# Altium project UZ_D_Encoder.PrjPcb (part 2 of 3)

## Sheet Busswitch_B.SchDoc
size A4; Author: Julian Klein; CompanyName: Technische Hochschule Nürnberg Georg Simon Ohm; Organization: UltraZohm; Address1: Kesslerplatz 12; Address2: 90489 Nürnberg; Address3: GERMANY; DocumentNumber: 12; SheetNumber: 12; SheetTotal: 12; Website: www.ultrazohm.com
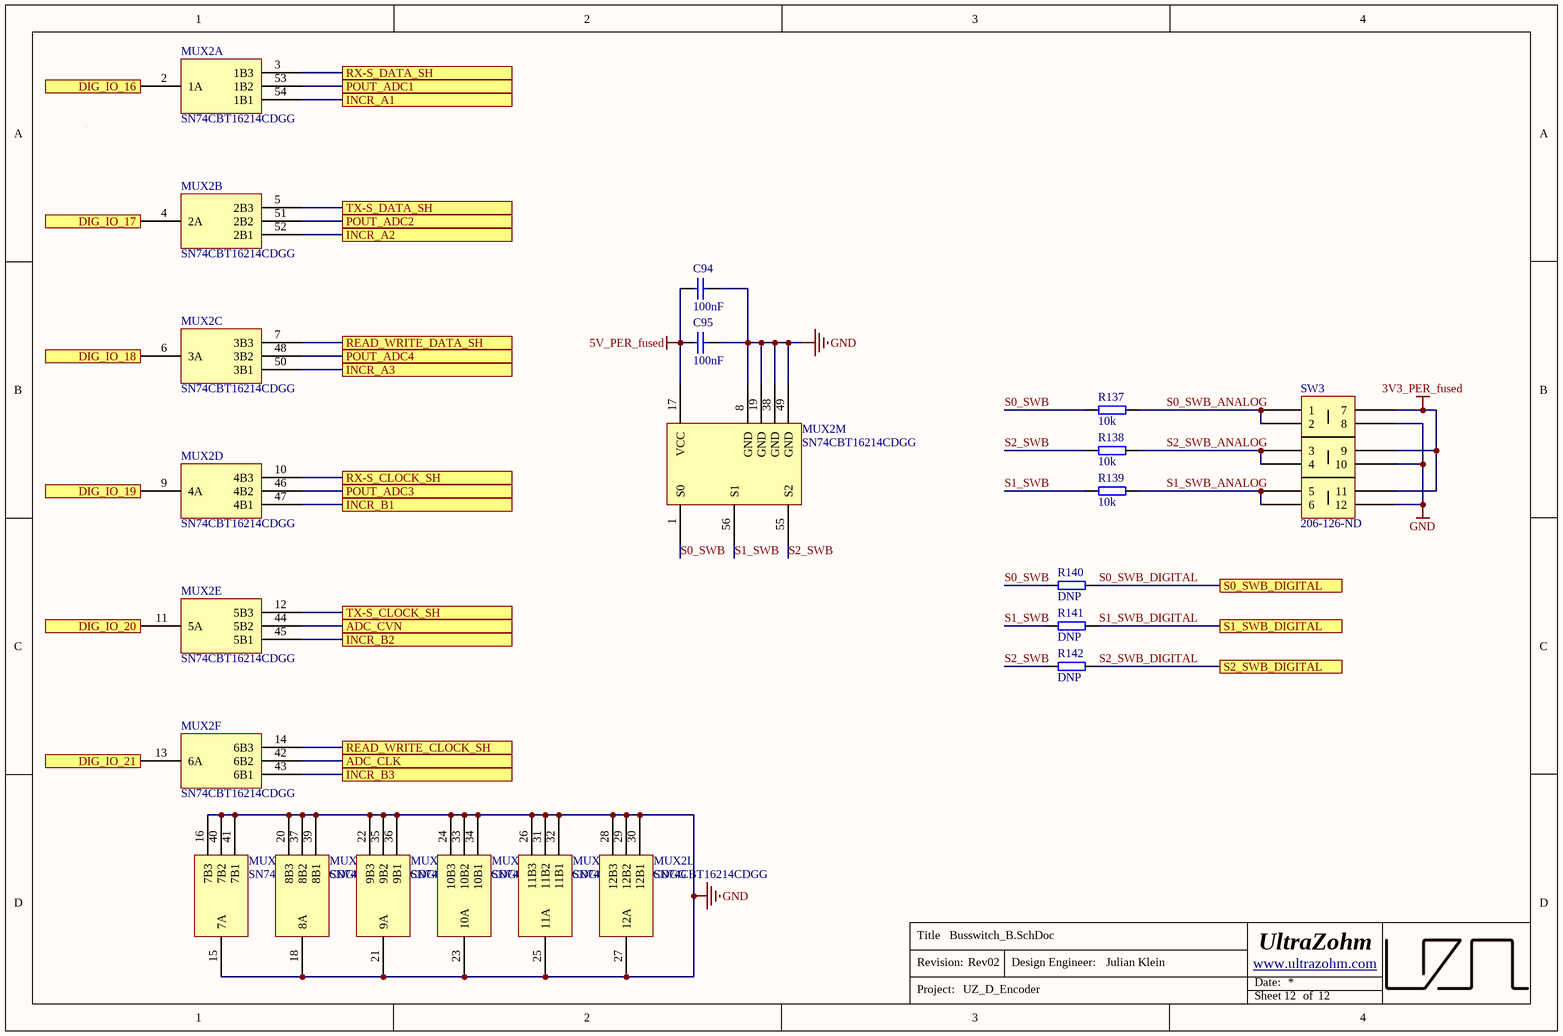
[diagram p8: Busswitch_B.SchDoc]

### Parts
C94  100nF  [CAPC1608X07N]
C95  100nF  [CAPC1608X07N]
MUX2  SN74CBT16214CDGG  [TSSOP50P810X120-56N]  (parts A,B,C,D,E,F,G,H,I,J,K,L,M of 13)
R137  10k  [RESC1608X06N]
R138  10k  [RESC1608X06N]
R139  10k  [RESC1608X06N]
R140  DNP  [RESC1608X06N]
R141  DNP  [RESC1608X06N]
R142  DNP  [RESC1608X06N]
SW3  Supplier Part Number 1: 206-126-ND  [206-123]  (hidden comment: 206-126)

### Ports
ADC_CLK, ADC_CVN, DIG_IO_16, DIG_IO_17, DIG_IO_18, DIG_IO_19, DIG_IO_20, DIG_IO_21, INCR_A1, INCR_A2, INCR_A3, INCR_B1, INCR_B2, INCR_B3, POUT_ADC1, POUT_ADC2, POUT_ADC3, POUT_ADC4, READ_WRITE_CLOCK_SH, READ_WRITE_DATA_SH, RX-S_CLOCK_SH, RX-S_DATA_SH, S0_SWB_DIGITAL, S1_SWB_DIGITAL, S2_SWB_DIGITAL, TX-S_CLOCK_SH, TX-S_DATA_SH

### Nets
3V3_PER_fused: SW3.7 SW3.9 SW3.11
5V_PER_fused: C94.1 C95.1 MUX2.17(VCC)
GND: C94.2 C95.2 MUX2.8(GND) MUX2.15(7A) MUX2.16(7B3) MUX2.18(8A) MUX2.19(GND) MUX2.20(8B3) MUX2.21(9A) MUX2.22(9B3) MUX2.23(10A) MUX2.24(10B3) MUX2.25(11A) MUX2.26(11B3) MUX2.27(12A) MUX2.28(12B3) MUX2.29(12B2) MUX2.30(12B1) MUX2.31(11B2) MUX2.32(11B1) MUX2.33(10B2) MUX2.34(10B1) MUX2.35(9B2) MUX2.36(9B1) MUX2.37(8B2) MUX2.38(GND) MUX2.39(8B1) MUX2.40(7B2) MUX2.41(7B1) MUX2.49(GND) SW3.8 SW3.10 SW3.12
ADC_CLK: MUX2.42(6B2) ; port ADC_CLK
ADC_CVN: MUX2.44(5B2) ; port ADC_CVN
ADC_OUT_P1: MUX2.53(1B2) ; port POUT_ADC1
ADC_OUT_P2: MUX2.51(2B2) ; port POUT_ADC2
ADC_OUT_P3: MUX2.46(4B2) ; port POUT_ADC3
ADC_OUT_P4: MUX2.48(3B2) ; port POUT_ADC4
DIG_IO_16: MUX2.2(1A) ; port DIG_IO_16
DIG_IO_17: MUX2.4(2A) ; port DIG_IO_17
DIG_IO_18: MUX2.6(3A) ; port DIG_IO_18
DIG_IO_19: MUX2.9(4A) ; port DIG_IO_19
DIG_IO_20: MUX2.11(5A) ; port DIG_IO_20
DIG_IO_21: MUX2.13(6A) ; port DIG_IO_21
INCR_A1: MUX2.54(1B1) ; port INCR_A1
INCR_A2: MUX2.52(2B1) ; port INCR_A2
INCR_A3: MUX2.50(3B1) ; port INCR_A3
INCR_B1: MUX2.47(4B1) ; port INCR_B1
INCR_B2: MUX2.45(5B1) ; port INCR_B2
INCR_B3: MUX2.43(6B1) ; port INCR_B3
READ_WRITE_CLOCK_SH: MUX2.14(6B3) ; port READ_WRITE_CLOCK_SH
READ_WRITE_DATA_SH: MUX2.7(3B3) ; port READ_WRITE_DATA_SH
RX-S_CLOCK_SH: MUX2.10(4B3) ; port RX-S_CLOCK_SH
RX-S_DATA_SH: MUX2.3(1B3) ; port RX-S_DATA_SH
S0_SWB: MUX2.1(S0) R137.2 R140.2
S0_SWB_ANALOG: R137.1 SW3.1 SW3.2
S0_SWB_DIGITAL: R140.1 ; port S0_SWB_DIGITAL  [project net P5]
S1_SWB: MUX2.56(S1) R139.2 R141.2
S1_SWB_ANALOG: R139.1 SW3.5 SW3.6
S1_SWB_DIGITAL: R141.1 ; port S1_SWB_DIGITAL  [project net P6]
S2_SWB: MUX2.55(S2) R138.2 R142.2
S2_SWB_ANALOG: R138.1 SW3.3 SW3.4
S2_SWB_DIGITAL: R142.1 ; port S2_SWB_DIGITAL  [project net P7]
TX-S_CLOCK_SH: MUX2.12(5B3) ; port TX-S_CLOCK_SH
TX-S_DATA_SH: MUX2.5(2B3) ; port TX-S_DATA_SH

### Notes on the sheet
- Title
- Revision:
- Design Engineer:
- Date:
- Project:
- Sheet
- of

### Library data of the parts
C94 C95 = Cap_0603: as C98 on sheet Analog Hall; Value: 100nF; Supplier 1: Mouser; Supplier 2: *; Supplier Part Number 1: 710-885012206071; Supplier Part Number 2: *
MUX2 = SN74CBT16214CDGG: Multiplexer/Demultiplexer Bus Switch 1-Element CMOS 36-IN 56-Pin TSSOP Tube; Manufacturer: Texas Instruments; Supplier 1: Arrow Electronics; Manufacturer Part Number: SN74CBT16214CDGG; RoHS: Yes; Case/Package: TSSOP; RoHS Compliant: Yes; Supplier Part Number 1: SN74CBT16214CDGG
R137-R142 = R_0603: MPN: CRCW06030000Z0EAC; MF: Vishay; Supplier 1: Mouser; Supplier Part Number 1: 71-CRCW06030000Z0EAC
  R137-R139: Value: 10k
  R140-R142: Value: DNP
SW3 = 206-126: Switch DIP OFF ON SPDT 6 Raised Slide 0.05A 24VDC PC Pins 2.54mm Thru-Hole Tube; Manufacturer: CTS; Body Material: Plastic; Voltage Rating (DC): 24V; Number of Positions: 6; Current Rating: 50mA; Electrical Life: 10000Cycles; Actuator Type: Slide (Standard); Pitch: 0.1inch; Washable: No; Supplier 1: Digi-Key; Manufacturer Part Number: 206-126; RoHS: Yes; Category: DIP Switches; Pricing 1: 1005=1,10898 (USD); Mount: Through Hole; Contact Plating: Gold; Min Operating Temperature: -55°C; Max Operating Temperature: 85°C; Packaging: Rail/Tube; Termination: PC Pin; Package Quantity: 15; Throw Configuration: SPDT; Series: 206; Max Voltage Rating (DC): 24V; Length: 1.286inch; Terminal Pitch: 2.54mm; Radiation Hardening: No; RoHS Compliant: Yes; ComponentLink1URL: https://datasheet.ciiva.com/8677/206-208-8677008.pdf?src-supplier=Avnet; ComponentLink1Description: https://datasheet.ciiva.com/8677/206-208-8677008.pdf?src-supplier=Avnet; ComponentLink2URL: https://datasheet.ciiva.com/12451/206-208-11732-12451385.pdf?src-supplier=Mouser; ComponentLink2Description: https://datasheet.ciiva.com/12451/206-208-11732-12451385.pdf?src-supplier=Mouser

## Sheet Busswitch_A.SchDoc
size A4; Author: Julian Klein; CompanyName: Technische Hochschule Nürnberg Georg Simon Ohm; Organization: UltraZohm; Address1: Kesslerplatz 12; Address2: 90489 Nürnberg; Address3: GERMANY; DocumentNumber: 12; SheetNumber: 12; SheetTotal: 12; Website: www.ultrazohm.com
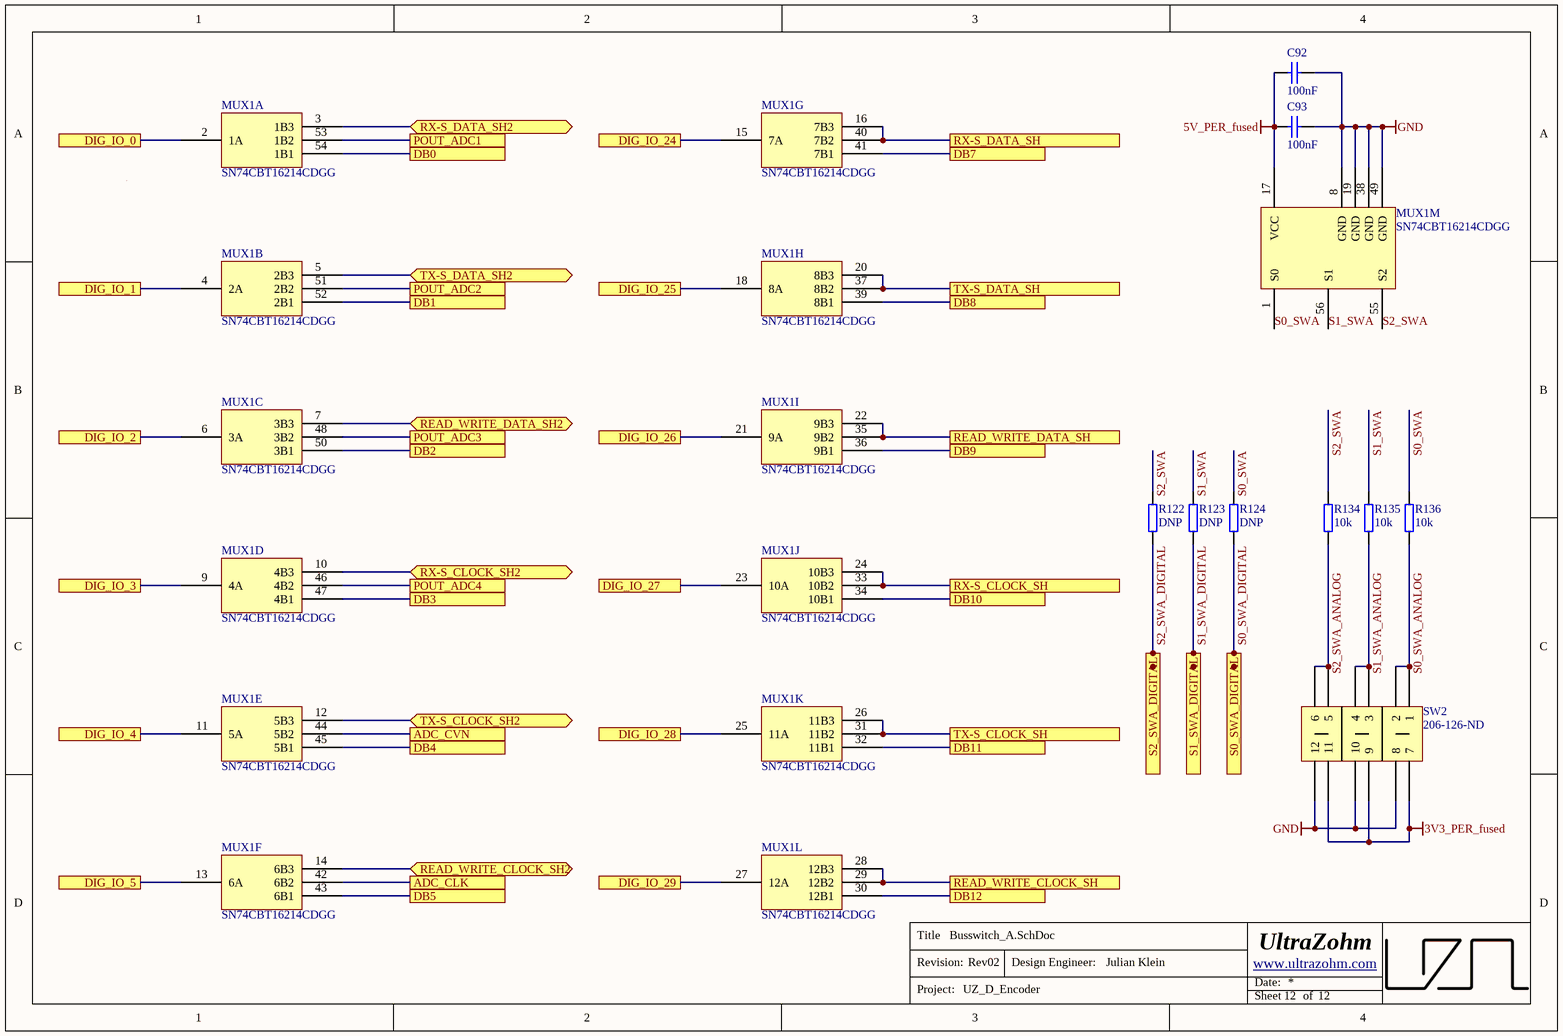
[diagram p9: Busswitch_A.SchDoc]

### Parts
C92  100nF  [CAPC1608X07N]
C93  100nF  [CAPC1608X07N]
MUX1  SN74CBT16214CDGG  [TSSOP50P810X120-56N]  (parts A,B,C,D,E,F,G,H,I,J,K,L,M of 13)
R122  DNP  [RESC1608X06N]
R123  DNP  [RESC1608X06N]
R124  DNP  [RESC1608X06N]
R134  10k  [RESC1608X06N]
R135  10k  [RESC1608X06N]
R136  10k  [RESC1608X06N]
SW2  Supplier Part Number 1: 206-126-ND  [206-123]  (hidden comment: 206-126)

### Ports
ADC_CLK, ADC_CVN, DB0, DB1, DB2, DB3, DB4, DB5, DB7, DB8, DB9, DB10, DB11, DB12, DIG_IO_0, DIG_IO_1, DIG_IO_2, DIG_IO_3, DIG_IO_4, DIG_IO_5, DIG_IO_24, DIG_IO_25, DIG_IO_26, DIG_IO_27, DIG_IO_28, DIG_IO_29, POUT_ADC1, POUT_ADC2, POUT_ADC3, POUT_ADC4, READ_WRITE_CLOCK_SH, READ_WRITE_CLOCK_SH2 (bidir), READ_WRITE_DATA_SH, READ_WRITE_DATA_SH2 (bidir), RX-S_CLOCK_SH, RX-S_CLOCK_SH2 (bidir), RX-S_DATA_SH, RX-S_DATA_SH2 (bidir), S0_SWA_DIGITAL, S1_SWA_DIGITAL, S2_SWA_DIGITAL, TX-S_CLOCK_SH, TX-S_CLOCK_SH2 (bidir), TX-S_DATA_SH, TX-S_DATA_SH2 (bidir)

### Nets
3V3_PER_fused: SW2.7 SW2.9 SW2.11
5V_PER_fused: C92.1 C93.1 MUX1.17(VCC)
GND: C92.2 C93.2 MUX1.8(GND) MUX1.19(GND) MUX1.38(GND) MUX1.49(GND) SW2.8 SW2.10 SW2.12
ADC_CLK: MUX1.42(6B2) ; port ADC_CLK
ADC_CVN: MUX1.44(5B2) ; port ADC_CVN
ADC_OUT_P1: MUX1.53(1B2) ; port POUT_ADC1
ADC_OUT_P2: MUX1.51(2B2) ; port POUT_ADC2
ADC_OUT_P3: MUX1.48(3B2) ; port POUT_ADC3
ADC_OUT_P4: MUX1.46(4B2) ; port POUT_ADC4
DB0: MUX1.54(1B1) ; port DB0
DB1: MUX1.52(2B1) ; port DB1
DB2: MUX1.50(3B1) ; port DB2
DB3: MUX1.47(4B1) ; port DB3
DB4: MUX1.45(5B1) ; port DB4
DB5: MUX1.43(6B1) ; port DB5
DB7: MUX1.41(7B1) ; port DB7
DB8: MUX1.39(8B1) ; port DB8
DB9: MUX1.36(9B1) ; port DB9
DB10: MUX1.34(10B1) ; port DB10
DB11: MUX1.32(11B1) ; port DB11
DB12: MUX1.30(12B1) ; port DB12
DIG_IO_0: MUX1.2(1A) ; port DIG_IO_0
DIG_IO_1: MUX1.4(2A) ; port DIG_IO_1
DIG_IO_2: MUX1.6(3A) ; port DIG_IO_2
DIG_IO_3: MUX1.9(4A) ; port DIG_IO_3
DIG_IO_4: MUX1.11(5A) ; port DIG_IO_4
DIG_IO_5: MUX1.13(6A) ; port DIG_IO_5
DIG_IO_24: MUX1.15(7A) ; port DIG_IO_24
DIG_IO_25: MUX1.18(8A) ; port DIG_IO_25
DIG_IO_26: MUX1.21(9A) ; port DIG_IO_26
DIG_IO_27: MUX1.23(10A) ; port DIG_IO_27
DIG_IO_28: MUX1.25(11A) ; port DIG_IO_28
DIG_IO_29: MUX1.27(12A) ; port DIG_IO_29
READ_WRITE_CLOCK_SH: MUX1.28(12B3) MUX1.29(12B2) ; port READ_WRITE_CLOCK_SH
READ_WRITE_DATA_SH: MUX1.22(9B3) MUX1.35(9B2) ; port READ_WRITE_DATA_SH
RX-S_CLOCK_SH: MUX1.24(10B3) MUX1.33(10B2) ; port RX-S_CLOCK_SH
RX-S_DATA_SH: MUX1.16(7B3) MUX1.40(7B2) ; port RX-S_DATA_SH
S0_SWA: MUX1.1(S0) R124.2 R136.2
S0_SWA_ANALOG: R136.1 SW2.1 SW2.2
S0_SWA_DIGITAL: R124.1 ; port S0_SWA_DIGITAL  [project net P0]
S1_SWA: MUX1.56(S1) R123.2 R135.2
S1_SWA_ANALOG: R135.1 SW2.3 SW2.4
S1_SWA_DIGITAL: R123.1 ; port S1_SWA_DIGITAL  [project net P1]
S2_SWA: MUX1.55(S2) R122.2 R134.2
S2_SWA_ANALOG: R134.1 SW2.5 SW2.6
S2_SWA_DIGITAL: R122.1 ; port S2_SWA_DIGITAL  [project net P2]
TX-S_CLOCK_SH: MUX1.26(11B3) MUX1.31(11B2) ; port TX-S_CLOCK_SH
TX-S_DATA_SH: MUX1.20(8B3) MUX1.37(8B2) ; port TX-S_DATA_SH
NetMUX1_3: MUX1.3(1B3) ; port RX-S_DATA_SH2
NetMUX1_5: MUX1.5(2B3) ; port TX-S_DATA_SH2
NetMUX1_7: MUX1.7(3B3) ; port READ_WRITE_DATA_SH2
NetMUX1_10: MUX1.10(4B3) ; port RX-S_CLOCK_SH2
NetMUX1_12: MUX1.12(5B3) ; port TX-S_CLOCK_SH2
NetMUX1_14: MUX1.14(6B3) ; port READ_WRITE_CLOCK_SH2

### Notes on the sheet
- Title
- Revision:
- Design Engineer:
- Date:
- Project:
- Sheet
- of

### Library data of the parts
C92 C93 = Cap_0603: as C98 on sheet Analog Hall; Value: 100nF; Supplier 1: Mouser; Supplier 2: *; Supplier Part Number 1: 710-885012206071; Supplier Part Number 2: *
MUX1 = SN74CBT16214CDGG: as MUX2 on sheet Busswitch_B; Supplier 1: Arrow Electronics; Manufacturer Part Number: SN74CBT16214CDGG; RoHS: Yes; Case/Package: TSSOP; RoHS Compliant: Yes; Supplier Part Number 1: SN74CBT16214CDGG
R122-R124 R134-R136 = R_0603: MPN: CRCW06030000Z0EAC; MF: Vishay; Supplier 1: Mouser; Supplier Part Number 1: 71-CRCW06030000Z0EAC
  R122-R124: Value: DNP
  R134-R136: Value: 10k
SW2 = 206-126: as SW3 on sheet Busswitch_B; Supplier 1: Digi-Key; Manufacturer Part Number: 206-126; RoHS: Yes; Category: DIP Switches; Pricing 1: 1005=1,10898 (USD); Mount: Through Hole; Contact Plating: Gold; Min Operating Temperature: -55°C; Max Operating Temperature: 85°C; Packaging: Rail/Tube; Termination: PC Pin; Package Quantity: 15; Throw Configuration: SPDT; Series: 206; Max Voltage Rating (DC): 24V; Length: 1.286inch; Terminal Pitch: 2.54mm; Radiation Hardening: No; RoHS Compliant: Yes; ComponentLink1URL: https://datasheet.ciiva.com/8677/206-208-8677008.pdf?src-supplier=Avnet; ComponentLink1Description: https://datasheet.ciiva.com/8677/206-208-8677008.pdf?src-supplier=Avnet; ComponentLink2URL: https://datasheet.ciiva.com/12451/206-208-11732-12451385.pdf?src-supplier=Mouser; ComponentLink2Description: https://datasheet.ciiva.com/12451/206-208-11732-12451385.pdf?src-supplier=Mouser

## Sheet Absolute Encoder.SchDoc
size A4; Author: Julian Klein; CompanyName: Technische Hochschule Nürnberg Georg Simon Ohm; Organization: UltraZohm; Address1: Kesslerplatz 12; Address2: 90489 Nürnberg; Address3: GERMANY; DocumentNumber: 2; SheetNumber: 2; SheetTotal: 12; Website: www.ultrazohm.com
Used 2 times, as channels Absolute encoder, Absolute encoder2. Parts and nets are listed once, with the designators drawn on the sheet.
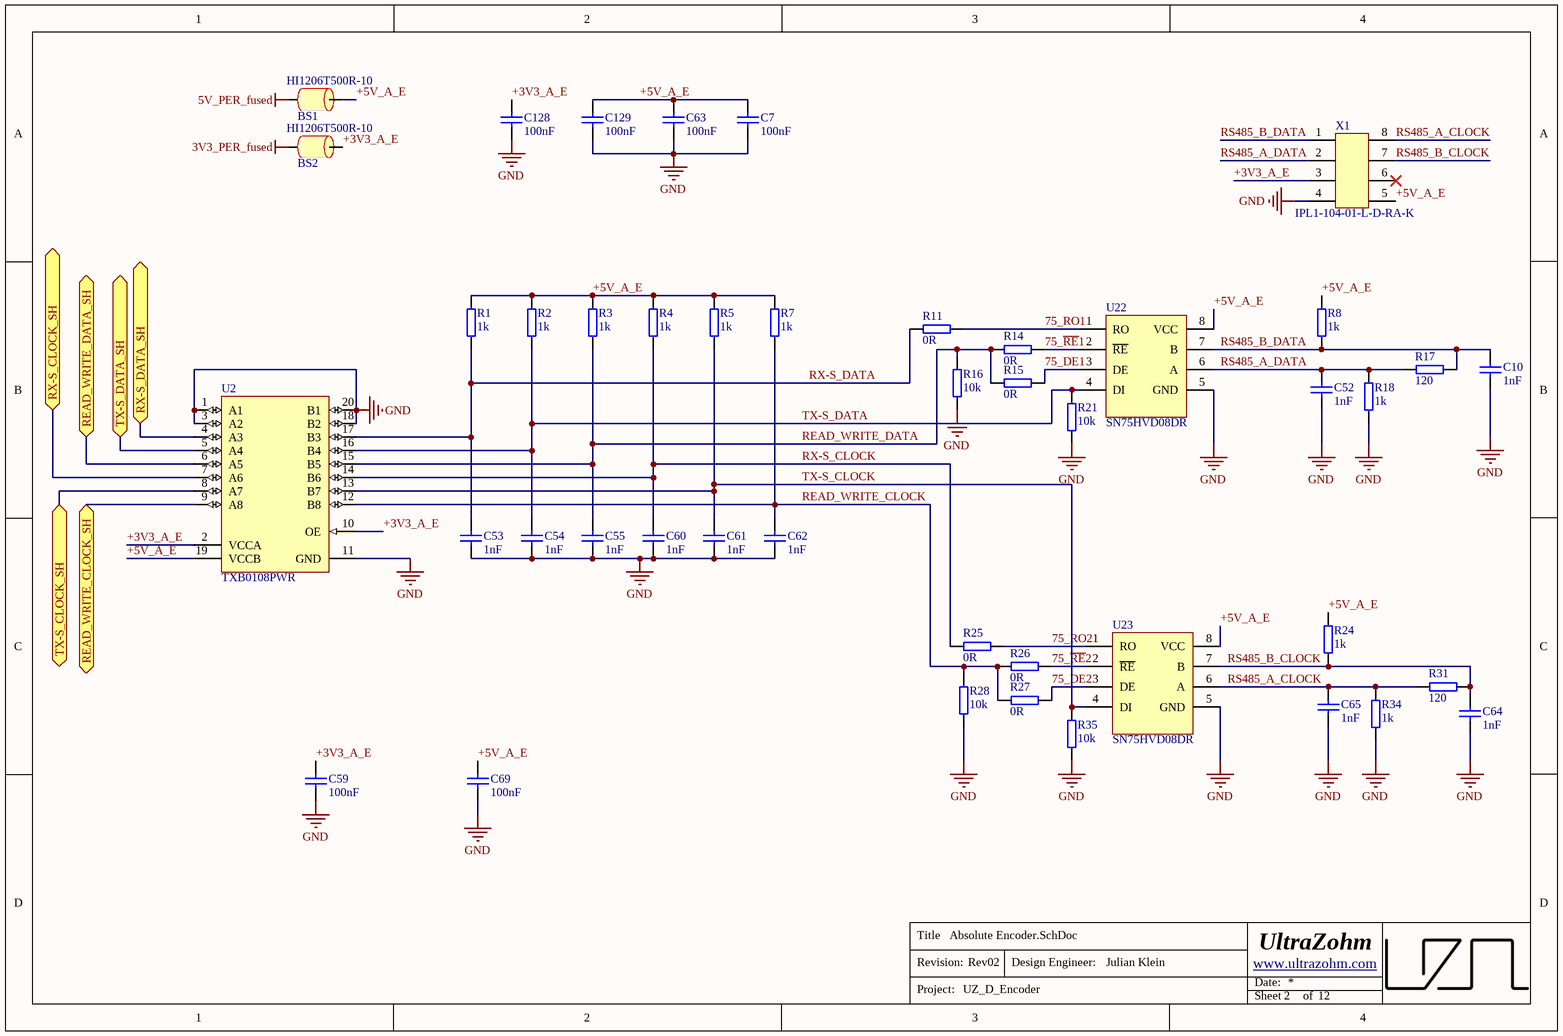
[diagram p10: Absolute Encoder.SchDoc]

### Parts
BS1  HI1206T500R-10  [RES_1206]
BS2  HI1206T500R-10  [RES_1206]
C7  100nF  [CAPC1608X07N]
C10  1nF  [CAPC1608X07N]
C52  1nF  [CAPC1608X07N]
C53  1nF  [CAPC1608X07N]
C54  1nF  [CAPC1608X07N]
C55  1nF  [CAPC1608X07N]
C59  100nF  [CAPC1608X07N]
C60  1nF  [CAPC1608X07N]
C61  1nF  [CAPC1608X07N]
C62  1nF  [CAPC1608X07N]
C63  100nF  [CAPC1608X07N]
C64  1nF  [CAPC1608X07N]
C65  1nF  [CAPC1608X07N]
C69  100nF  [CAPC1608X07N]
C128  100nF  [CAPC1608X07N]
C129  100nF  [CAPC1608X07N]
R1  1k  [RESC1608X06N]
R2  1k  [RESC1608X06N]
R3  1k  [RESC1608X06N]
R4  1k  [RESC1608X06N]
R5  1k  [RESC1608X06N]
R7  1k  [RESC1608X06N]
R8  1k  [RESC1608X06N]
R11  0R  [RESC1608X06N]
R14  0R  [RESC1608X06N]
R15  0R  [RESC1608X06N]
R16  10k  [RESC1608X06N]
R17  120  [RESC1608X06N]
R18  1k  [RESC1608X06N]
R21  10k  [RESC1608X06N]
R24  1k  [RESC1608X06N]
R25  0R  [RESC1608X06N]
R26  0R  [RESC1608X06N]
R27  0R  [RESC1608X06N]
R28  10k  [RESC1608X06N]
R31  120  [RESC1608X06N]
R34  1k  [RESC1608X06N]
R35  10k  [RESC1608X06N]
U2  TXB0108PWR  [PW0020A_L]
U22  SN75HVD08DR  [SOIC8_N]
U23  SN75HVD08DR  [SOIC8_N]
X1  IPL1-104-01-L-D-RA-K  [Conector 4x2 TH Horizontal]

### Ports
READ_WRITE_CLOCK_SH (bidir), READ_WRITE_DATA_SH (bidir), RX-S_CLOCK_SH (bidir), RX-S_DATA_SH (bidir), TX-S_CLOCK_SH (bidir), TX-S_DATA_SH (bidir)

### Nets
3V3_PER_fused: BS2.2
5V_PER_fused: BS1.2
GND: C7.2 C10.2 C52.2 C53.2 C54.2 C55.2 C59.2 C60.2 C61.2 C62.2 C63.2 C64.2 C65.2 C69.2 C128.2 C129.2 R16.1 R18.1 R21.1 R28.1 R34.1 R35.1 U2.1(A1) U2.3(A2) U2.11(GND) U2.18(B2) U2.20(B1) U22.5(GND) U23.5(GND) X1.4
75_DE1: R15.2 U22.3(DE)
75_DE2: R27.2 U23.3(DE)
75_~{RE}1: R14.2 U22.2(~{RE})
75_~{RE}2: R26.2 U23.2(~{RE})
75_RO1: R11.2 U22.1(RO)
75_RO2: R25.2 U23.1(RO)
+3V3_A_E: BS2.1 C59.1 C128.1 U2.2(VCCA) U2.10(OE) X1.3
+5V_A_E: BS1.1 C7.1 C63.1 C69.1 C129.1 R1.2 R2.2 R3.2 R4.2 R5.2 R7.2 R8.2 R24.2 U2.19(VCCB) U22.8(VCC) U23.8(VCC) X1.5
READ_WRITE_CLOCK: C62.1 R7.1 R26.1 R27.1 R28.2 U2.12(B8)
READ_WRITE_CLOCK_SH: U2.9(A8) ; port READ_WRITE_CLOCK_SH
READ_WRITE_DATA: C55.1 R3.1 R14.1 R15.1 R16.2 U2.15(B5)
READ_WRITE_DATA_SH: U2.6(A5) ; port READ_WRITE_DATA_SH
RS485_A_CLOCK: C65.1 R31.2 R34.2 U23.6(A) X1.8
RS485_A_DATA: C52.1 R17.2 R18.2 U22.6(A) X1.2
RS485_B_CLOCK: C64.1 R24.1 R31.1 U23.7(B) X1.7
RS485_B_DATA: C10.1 R8.1 R17.1 U22.7(B) X1.1
RX-S_CLOCK: C60.1 R4.1 R25.1 U2.14(B6)
RX-S_CLOCK_SH: U2.7(A6) ; port RX-S_CLOCK_SH
RX-S_DATA: C53.1 R1.1 R11.1 U2.17(B3)
RX-S_DATA_SH: U2.4(A3) ; port RX-S_DATA_SH
TX-S_CLOCK: C61.1 R5.1 R35.2 U2.13(B7) U23.4(DI)
TX-S_CLOCK_SH: U2.8(A7) ; port TX-S_CLOCK_SH
TX-S_DATA: C54.1 R2.1 R21.2 U2.16(B4) U22.4(DI)
TX-S_DATA_SH: U2.5(A4) ; port TX-S_DATA_SH

Not connected (* = marked no-connect by the designer): X1 6*

### Channels
Absolute encoder: designators end in A; ports READ_WRITE_CLOCK_SH=READ_WRITE_CLOCK_SH READ_WRITE_DATA_SH=READ_WRITE_DATA_SH RX-S_CLOCK_SH=RX-S_CLOCK_SH RX-S_DATA_SH=RX-S_DATA_SH TX-S_CLOCK_SH=TX-S_CLOCK_SH TX-S_DATA_SH=TX-S_DATA_SH
Absolute encoder2: designators end in B; ports READ_WRITE_CLOCK_SH=NetMUX1_14 READ_WRITE_DATA_SH=NetMUX1_7 RX-S_CLOCK_SH=NetMUX1_3 RX-S_DATA_SH=NetMUX1_10 TX-S_CLOCK_SH=NetMUX1_12 TX-S_DATA_SH=NetMUX1_5

### Notes on the sheet
- Title
- Revision:
- Design Engineer:
- Date:
- Project:
- Sheet
- of

### Library data of the parts
BS1 BS2 = Bead: Ferrite bead 6A; MF: Laird; Supplier Part Number 2: 240-2412-1-ND; MFN: HI1206T500R-10; Supplier 2: Digi-Key; Supplier 1: Mouser; Supplier Part Number 1: 875-HI1206T500R-10; Package: 1206
C7 C63 C69 C129 = Cap_0603: MPN: 885012206071; MF: Würth; Voltage: 16V; Value: 100nF; Supplier 1: Mouser; Supplier 2: *; Supplier Part Number 1: 710-885012206071; Supplier Part Number 2: *
C10 C52 C64 C65 = Cap_0603: Voltage: 16V; Value: 1nF; MF: *; MPN: *; Supplier 1: *; Supplier 2: *; Supplier Part Number 1: *; Supplier Part Number 2: *
C53-C55 C59-C62 C128 = Cap_0603: as C98 on sheet Analog Hall; Supplier 1: Mouser; Supplier 2: *; Supplier Part Number 1: 710-885012206071; Supplier Part Number 2: *
  C53-C55 C60-C62: Value: 1nF
  C59 C128: Value: 100nF
R1-R5 R7 R8 R18 R24 R34 = R_0603: MPN: RC0603FR-071KL; MF: Yageo; Value: 1k; Supplier 1: Mouser; Supplier Part Number 1: 603-RC0603FR-071KL
R11 R14-R16 R21 R25-R28 R35 = R_0603: MPN: CRCW06030000Z0EAC; MF: Vishay; Supplier 1: Mouser; Supplier Part Number 1: 71-CRCW06030000Z0EAC
  R11 R14 R15 R25-R27: Value: 0R
  R16 R21 R28 R35: Value: 10k
R17 R31 = R_0603: Value: 120; MF: *; MPN: *; Supplier 1: *; Supplier Part Number 1: *
U2 = CMP-2000-07337-1: TXB0108 8-Bit Bidirectional Voltage-Level Translator with Auto-Direction Sensing and / +/- 15-kV ESD Protection, 1.2 to 3.6 V, -40 to 85 degC, 20-Pin TSSOP (PW), Green (RoHS & no Sb/Br), Tape and Reel; Manufacturer: Texas Instruments; Propagation Delay (Max): 4ns; Logic Function: Translator,Bidirectional; Input Type: Logic; Package Version: 4040064-5/G, 02/2011; Voltage - Supply: 1.2V~3.6V,1.65V~5.5V; Data Rate: 100Mbps; Other Names: 296-21527-6; Number of Channels: 8; Differential - Input: Output:No/No; Number of Outputs/Channel: 1; Product Training Modules: VoltageLevelTranslation; Dynamic Catalog: TXBSeries; Package Reference: PW20; Package Description: 20-Pin Small Outline Package Integrated Circuit, Body 6.5 x 4.4 mm, Pitch 0.65 mm; Category: IntegratedCircuits(ICs); Datasheet URL: http://www.ti.com/general/docs/lit/getliterature.tsp?genericPartNumber=TXB0108&fileType=pdf; Package / Case: 20-TSSOP(0.173",4.40mmWidth); Family: Logic-Translators; Standard Package: 1; Series: -; Manufacturer URL: http://www.ti.com/; Number of Bits: 8; Package URL: http://www.ti.com/litv/pdf/mpds362; Output Type: Logic; Datasheet Version: Rev. F, 12/2014; Packaging: Digi-Reel®; Operating Temperature: -40°C~85°C; Supplier Device Package: 20-TSSOP; Mounting Technology: SurfaceMount
U22 U23 = Transmisor RS485: IC TRANSCEIVER HALF 1/1 8SOIC; MF: Texas Instruments; Supplier Part Number 2: 296-37893-1-ND; MPN: SN75HVD08DR; Supplier Part Number 1: 595-SN75HVD08DR; Package: SOIC-8; Supplier 1: Mouser; Supplier 2: Digi-Key
X1 = Conector 4x2 Horizontal: CONN HEADER R/A 8POS 2.54MM Through Hole; MF: Samtec; Supplier Part Number 2: SAM9596-ND; MPN: IPL1-104-01-L-D-RA-K; Supplier Part Number 1: 200-IPL110401LDRAK; Supplier 1: Mouser; Supplier 2: Digi-Key

## Sheet Resolver.SchDoc
size A4; Author: Julian Klein; CompanyName: Technische Hochschule Nürnberg Georg Simon Ohm; Organization: UltraZohm; Address1: Kesslerplatz 12; Address2: 90489 Nürnberg; Address3: GERMANY; DocumentNumber: 10; SheetNumber: 10; SheetTotal: 12; Website: www.ultrazohm.com
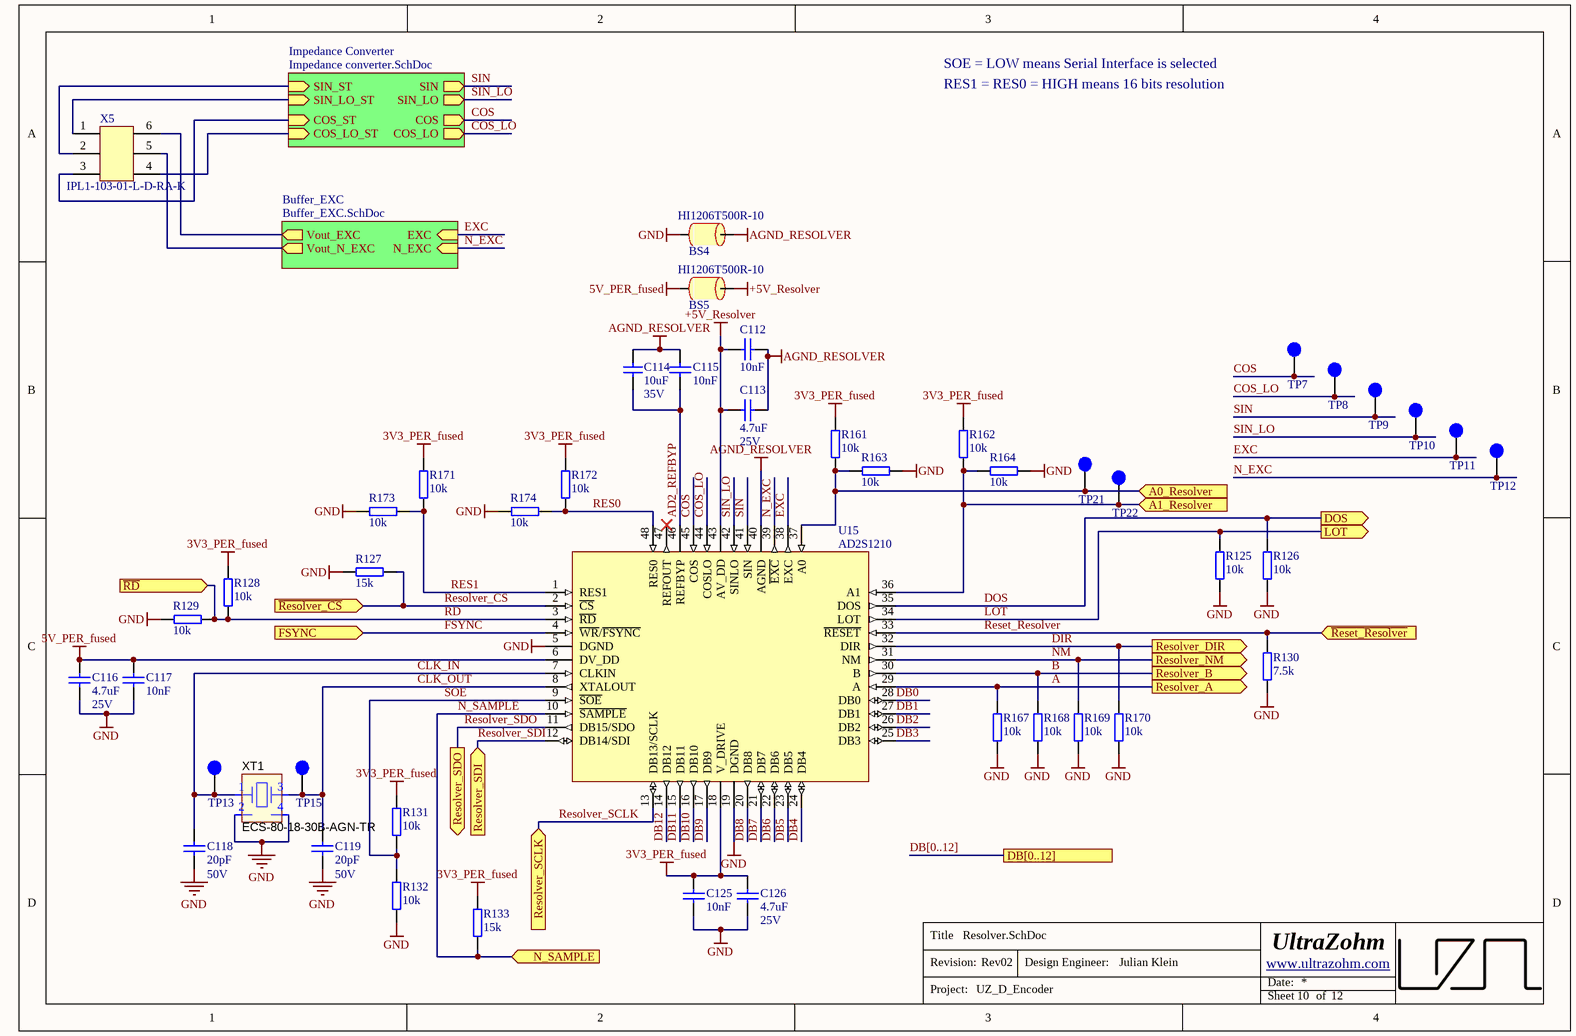
[diagram p11: Resolver.SchDoc]

### Parts
BS4  HI1206T500R-10  [RES_1206]
BS5  HI1206T500R-10  [RES_1206]
C112  10nF  [CAPC1608X07N]
C113  4.7uF  Voltage: 25V  [CAPC1608X07N]
C114  10uF  Voltage: 35V  [C_1206]
C115  10nF  [CAPC1608X07N]
C116  4.7uF  Voltage: 25V  [CAPC1608X07N]
C117  10nF  [CAPC1608X07N]
C118  20pF  Voltage: 50V  [CAPC1608X07N]
C119  20pF  Voltage: 50V  [CAPC1608X07N]
C125  10nF  [CAPC1608X07N]
C126  4.7uF  Voltage: 25V  [CAPC1608X07N]
R125  10k  [RESC1608X06N]
R126  10k  [RESC1608X06N]
R127  15k  [RESC1608X06N]
R128  10k  [RESC1608X06N]
R129  10k  [RESC1608X06N]
R130  7.5k  [RESC1608X06N]
R131  10k  [RESC1608X06N]
R132  10k  [RESC1608X06N]
R133  15k  [RESC1608X06N]
R161  10k  [RESC1608X06N]
R162  10k  [RESC1608X06N]
R163  10k  [RESC1608X06N]
R164  10k  [RESC1608X06N]
R167  10k  [RESC1608X06N]
R168  10k  [RESC1608X06N]
R169  10k  [RESC1608X06N]
R170  10k  [RESC1608X06N]
R171  10k  [RESC1608X06N]
R172  10k  [RESC1608X06N]
R173  10k  [RESC1608X06N]
R174  10k  [RESC1608X06N]
TP7  VCC  [TP_1mm]  (value not drawn)
TP8  VCC  [TP_1mm]  (value not drawn)
TP9  VCC  [TP_1mm]  (value not drawn)
TP10  VCC  [TP_1mm]  (value not drawn)
TP11  VCC  [TP_1mm]  (value not drawn)
TP12  VCC  [TP_1mm]  (value not drawn)
TP13  VCC  [TP_1mm]  (value not drawn)
TP15  VCC  [TP_1mm]  (value not drawn)
TP21  VCC  [TP_1mm]  (value not drawn)
TP22  VCC  [TP_1mm]  (value not drawn)
U15  AD2S1210  [LQFP-48_L]
X5  IPL1-103-01-L-D-RA-K  [Conector 3x2 TH Horizontal]
XT1  ECS-80-18-30B-AGN-TR  [CRYSTALOSC]

### Sub-sheets
Buffer_EXC = Buffer_EXC.SchDoc: Vout_EXC (out), Vout_N_EXC (out), N_EXC (in), EXC (in)
Impedance Converter = Impedance converter.SchDoc: SIN_LO (out), COS_LO_ST (in), SIN_ST (in), SIN_LO_ST (in), COS_ST (in), SIN (out), COS_LO (out), COS (out)

### Ports
A0_Resolver (in), A1_Resolver (in), DB[0..12], DOS (out), FSYNC (in), LOT (out), N_SAMPLE (in), Resolver_A (out), Resolver_B (out), Resolver_DIR (out), Resolver_NM (out), Resolver_SCLK (in), Resolver_SDI (in), Resolver_SDO (out), ~{RD} (in), ~{Reset_Resolver} (in), ~{Resolver_CS} (in)

### Nets
3V3_PER_fused: C125.2 C126.2 R128.2 R131.2 R133.2 R161.2 R162.2 R171.2 R172.2 U15.18(V_DRIVE)
5V_PER_fused: BS5.2 C116.2 C117.2 U15.6(DV_DD)
+5V_Resolver: BS5.1 C112.1 C113.1 U15.43(AV_DD)
AGND_RESOLVER: BS4.1 C112.2 C113.2 C114.2 C115.2 U15.40(AGND)
GND: BS4.2 C116.1 C117.1 C118.2 C119.2 C125.1 C126.1 R125.1 R126.1 R127.2 R129.1 R130.2 R132.1 R163.1 R164.1 R167.1 R168.1 R169.1 R170.1 R173.1 R174.1 U15.5(DGND) U15.19(DGND) XT1.2(GND) XT1.4(GND)
~{RD}: R128.1 R129.2 U15.3(~{RD}) ; port ~{RD}
~{Reset_Resolver}: R130.1 U15.33(~{RESET}) ; port ~{Reset_Resolver}
~{Resolver_CS}: R127.1 U15.2(~{CS}) ; port ~{Resolver_CS}
~{SOE}: R131.1 R132.2 U15.9(~{SOE})
A: R167.2 U15.29(A) ; port Resolver_A
AD2_REFBYP: C114.1 C115.1 U15.46(REFBYP)
B: R168.2 U15.30(B) ; port Resolver_B
CLK_IN: C118.1 TP13.1 U15.7(CLKIN) XT1.1(IN)
CLK_OUT: C119.1 TP15.1 U15.8(XTALOUT) XT1.3(OUT)
COS: TP7.1 U15.45(COS) ; sheet Impedance Converter/COS
COS_LO: TP8.1 U15.44(COSLO) ; sheet Impedance Converter/COS_LO
COS_LO_ST: X5.4 ; sheet Impedance Converter/COS_LO_ST
COS_ST: X5.3 ; sheet Impedance Converter/COS_ST
DB0: U15.28(DB0)
DB1: U15.27(DB1)
DB2: U15.26(DB2)
DB3: U15.25(DB3)
DB4: U15.24(DB4)
DB5: U15.23(DB5)
DB6: U15.22(DB6)
DB7: U15.21(DB7)
DB8: U15.20(DB8)
DB9: U15.17(DB9)
DB10: U15.16(DB10)
DB11: U15.15(DB11)
DB12: U15.14(DB12)
DIG_IO_14: R162.1 R164.2 TP22.1 U15.36(A1) ; port A1_Resolver
DIG_IO_15: R161.1 R163.2 TP21.1 U15.37(A0) ; port A0_Resolver
DIR: R170.2 U15.32(DIR) ; port Resolver_DIR
DOS: R126.2 U15.35(DOS) ; port DOS
EXC: TP11.1 U15.38(EXC) ; sheet Buffer_EXC/EXC
FSYNC: U15.4(~{WR}/~{FSYNC}) ; port FSYNC  [project net DIG_IO_11]
LOT: R125.2 U15.34(LOT) ; port LOT
N_EXC: TP12.1 U15.39(~{EXC}) ; sheet Buffer_EXC/N_EXC
N_SAMPLE: R133.1 U15.10(~{SAMPLE}) ; port N_SAMPLE  [project net DIG_IO_12]
NM: R169.2 U15.31(NM) ; port Resolver_NM
RES0: R172.1 R174.2 U15.48(RES0)
RES1: R171.1 R173.2 U15.1(RES1)
Resolver_SCLK: U15.13(DB13/SCLK) ; port Resolver_SCLK
Resolver_SDI: U15.12(DB14/SDI) ; port Resolver_SDI
Resolver_SDO: U15.11(DB15/SDO) ; port Resolver_SDO
SIN: TP9.1 U15.41(SIN) ; sheet Impedance Converter/SIN
SIN_LO: TP10.1 U15.42(SINLO) ; sheet Impedance Converter/SIN_LO
SIN_LO_ST: X5.1 ; sheet Impedance Converter/SIN_LO_ST
SIN_ST: X5.2 ; sheet Impedance Converter/SIN_ST
Vout_EXC: X5.6 ; sheet Buffer_EXC/Vout_EXC
Vout_N_EXC: X5.5 ; sheet Buffer_EXC/Vout_N_EXC

Not connected (* = marked no-connect by the designer): U15 47(REFOUT)*

### Buses and harness runs
bus DB[0..12] = port DB[0..12]

### Notes on the sheet
- SOE = LOW means Serial Interface is selected
- RES1 = RES0 = HIGH means 16 bits resolution
- Title
- Revision:
- Design Engineer:
- Date:
- Project:
- Sheet
- of

### Library data of the parts
BS4 BS5 = Bead: Ferrite bead 6A; MF: Laird; Supplier Part Number 2: 240-2412-1-ND; MFN: HI1206T500R-10; Supplier 2: Digi-Key; Supplier 1: Mouser; Supplier Part Number 1: 875-HI1206T500R-10; Package: 1206
C112 C115 C117 C125 = Cap_0603: MPN: 885012206065; MF: Würth; Voltage: 25V; Value: 10nF; Supplier 1: Mouser; Supplier 2: *; Supplier Part Number 1: 710-885012206065; Supplier Part Number 2: *
C113 C116 C118 C119 C126 = Cap_0603: MF: *; MPN: *; Supplier 1: *; Supplier 2: *; Supplier Part Number 1: *; Supplier Part Number 2: *
  C113 C116 C126: Value: 4.7uF
  C118 C119: Value: 20pF
C114 = C_1206: Capacitor 1206; MPN: GRM319R6YA106KA12D; Tolerance: 10%; MF: Murata Electronics; Dielectric: X5R; Package: 1206; Value: 10uF; Created: 2018_06_25_AGeiger; Supplier 1: Mouser; Supplier Part Number 1: 81-GRM319R6YA106KA2D
R125-R129 R131-R133 R161-R164 R167-R174 = R_0603: MPN: CRCW06030000Z0EAC; MF: Vishay; Supplier 1: Mouser; Supplier Part Number 1: 71-CRCW06030000Z0EAC
  R125 R126 R128 R129 R131 R132 R161-R164 R167-R174: Value: 10k
  R127 R133: Value: 15k
R130 = R_0603: Value: 7.5k; Supplier 1: Mouser
TP7-TP13 TP15 TP21 TP22 = TP_1mm: Testpoint 1mm; Created: 2018_06_25_AGeiger; Value: Testpoint 1mm
U15 = AD2S1210: Variable Resolution, 10-Bit to 16-Bit R/D Converter with Reference Oscillator; MPN: AD2S1210WDSTZRL7; MF: Analog Devices; Package: LQFP-48; Value: AD2S1210; Created: 2019_04_20_AGeiger; ComponentLink1Description: Datasheet; ComponentLink1URL: https://www.analog.com/media/en/technical-documentation/data-sheets/AD2S1210.pdf; Supplier 1: Mouser; Supplier Part Number 1: 584-AD2S1210WDSTZR7; Supplier Part Number 2: AD2S1210WDSTZRL7CT-ND; Supplier 2: Digi-Key
X5 = Conector 3x2 Horizontal: CONN HEADER R/A 6 POS 2.54MM Through Hole; MF: Samtec; Supplier Part Number 2: SAM9096-ND; MPN: IPL1-103-01-L-D-RA-K; Supplier Part Number 1: 200-IPL110301LDRAK; Supplier 1: Mouser; Supplier 2: Digi-Key
XT1 = Crystal_8MHz: CRYSTAL 8MHZ 18PF SMD; MF: ECS; Supplier Part Number 2: XC2709CT-ND; MPN: ECS-80-18-30B-AGN-TR; Supplier Part Number 1: 520-80-18-30B-AGNT; Supplier 1: Mouser; Package: 4-SMD; Supplier 2: Digi-Key

## Sheet Buffer_EXC.SchDoc
size A4; Author: Julian Klein; CompanyName: Technische Hochschule Nürnberg Georg Simon Ohm; Organization: UltraZohm; Address1: Kesslerplatz 12; Address2: 90489 Nürnberg; Address3: GERMANY; DocumentNumber: 11; SheetNumber: 11; SheetTotal: 12; Website: www.ultrazohm.com
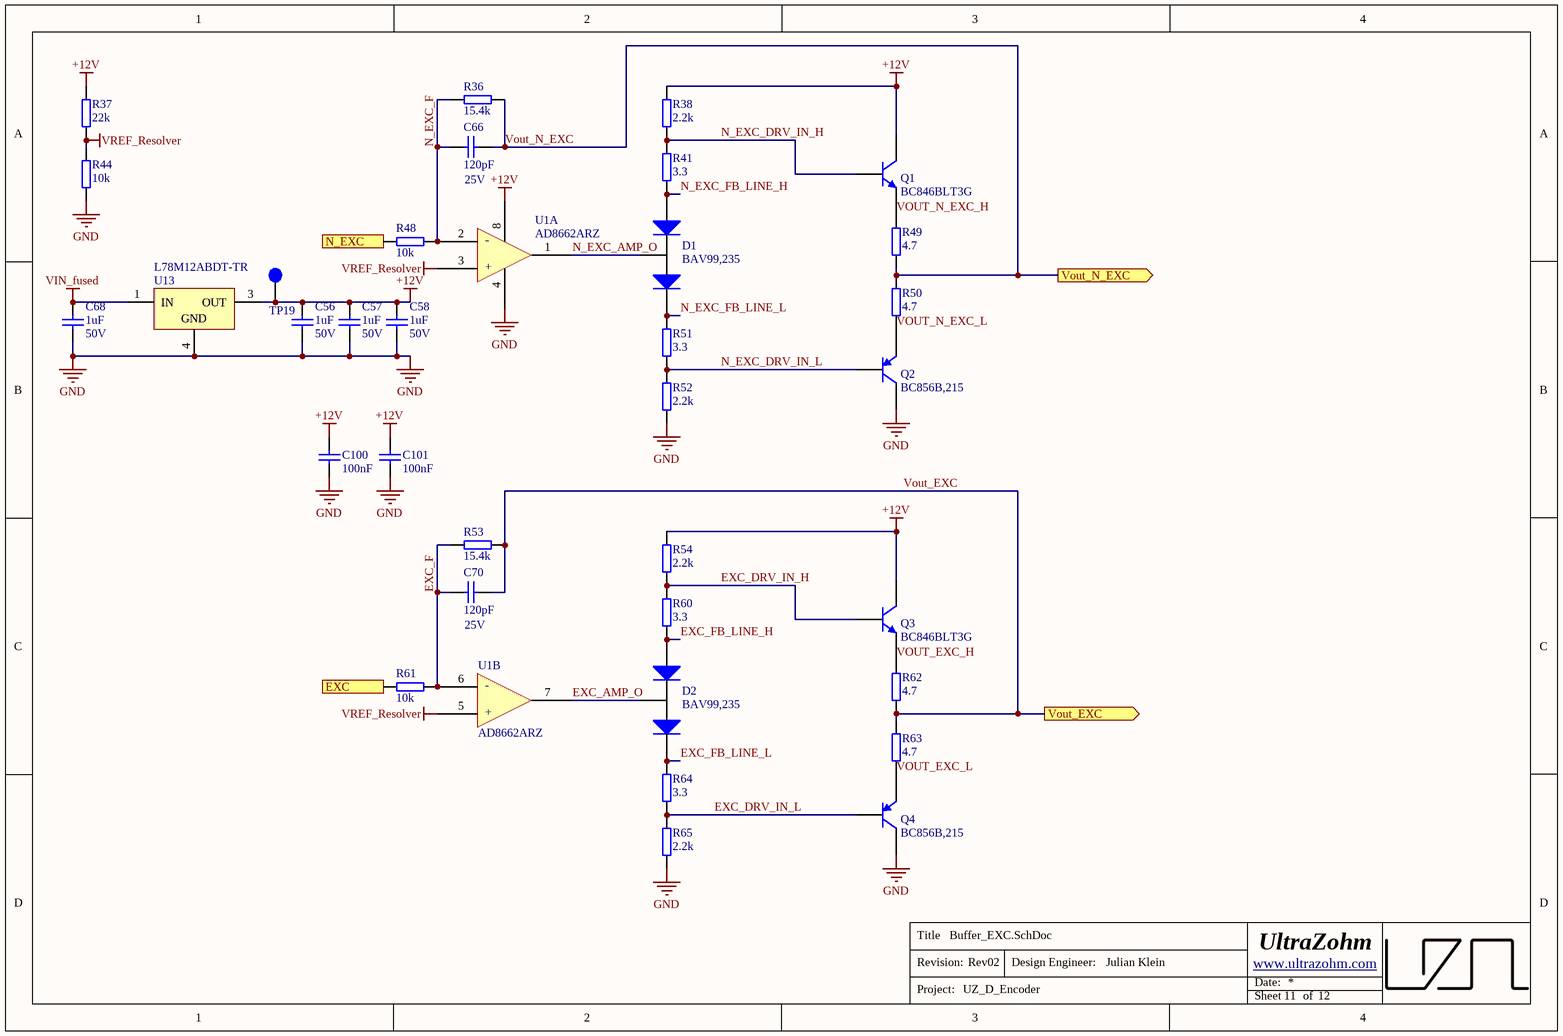
[diagram p12: Buffer_EXC.SchDoc]

### Parts
C56  1uF  Voltage: 50V  [RES_1206]
C57  1uF  Voltage: 50V  [RES_1206]
C58  1uF  Voltage: 50V  [RES_1206]
C66  120pF  Voltage: 25V  [CAPC1608X07N]
C68  1uF  Voltage: 50V  [RES_1206]
C70  120pF  Voltage: 25V  [CAPC1608X07N]
C100  100nF  [CAPC1608X07N]
C101  100nF  [CAPC1608X07N]
D1  BAV99,235  [SOT-23]
D2  BAV99,235  [SOT-23]
Q1  BC846BLT3G  [SOT-23]
Q2  BC856B,215  [SOT-23]
Q3  BC846BLT3G  [SOT-23]
Q4  BC856B,215  [SOT-23]
R36  15.4k  [RESC1608X06N]
R37  22k  [RESC1608X06N]
R38  2.2k  [RESC1608X06N]
R41  3.3  [RESC1608X06N]
R44  10k  [RESC1608X06N]
R48  10k  [RESC1608X06N]
R49  4.7  [RESC1608X06N]
R50  4.7  [RESC1608X06N]
R51  3.3  [RESC1608X06N]
R52  2.2k  [RESC1608X06N]
R53  15.4k  [RESC1608X06N]
R54  2.2k  [RESC1608X06N]
R60  3.3  [RESC1608X06N]
R61  10k  [RESC1608X06N]
R62  4.7  [RESC1608X06N]
R63  4.7  [RESC1608X06N]
R64  3.3  [RESC1608X06N]
R65  2.2k  [RESC1608X06N]
TP19  VCC  [TP_1mm]  (value not drawn)
U1  AD8662ARZ  [SOIC8_N]  (parts A,B of 2)
U13  L78M12ABDT-TR  [TO-252_M]

### Ports
EXC (in), N_EXC (in), Vout_EXC (out), Vout_N_EXC (out)

### Nets
+12V: C56.1 C57.1 C58.1 C100.1 C101.1 Q1.3(C) Q3.3(C) R37.2 R38.2 R54.2 TP19.1 U1.8(v-) U13.3(OUT)
GND: C56.2 C57.2 C58.2 C68.2 C100.2 C101.2 Q2.3(C) Q4.3(C) R44.1 R52.2 R65.2 U1.4(v+) U13.4(GND)
VIN_fused: C68.1 U13.1(IN)
VREF_Resolver: R37.1 R44.2 U1.3(+in_a) U1.5(+in_b)
EXC: R61.2 ; port EXC
EXC_AMP_O: D2.3 U1.7(out_b)
EXC_DRV_IN_H: Q3.1(B) R54.1 R60.2
EXC_DRV_IN_L: Q4.1(B) R64.2 R65.1
EXC_F: C70.1 R53.1 R61.1 U1.6(-in_b)
EXC_FB_LINE_H: D2.1 R60.1
EXC_FB_LINE_L: D2.2 R64.1
N_EXC: R48.2 ; port N_EXC
N_EXC_AMP_O: D1.3 U1.1(out_a)
N_EXC_DRV_IN_H: Q1.1(B) R38.1 R41.2
N_EXC_DRV_IN_L: Q2.1(B) R51.2 R52.1
N_EXC_F: C66.1 R36.1 R48.1 U1.2(-in_a)
N_EXC_FB_LINE_H: D1.1 R41.1
N_EXC_FB_LINE_L: D1.2 R51.1
Vout_EXC: C70.2 R53.2 R62.2 R63.1 ; port Vout_EXC
VOUT_EXC_H: Q3.2(E) R62.1
VOUT_EXC_L: Q4.2(E) R63.2
Vout_N_EXC: C66.2 R36.2 R49.2 R50.1 ; port Vout_N_EXC
VOUT_N_EXC_H: Q1.2(E) R49.1
VOUT_N_EXC_L: Q2.2(E) R50.2

### Notes on the sheet
- Title
- Revision:
- Design Engineer:
- Date:
- Project:
- Sheet
- of
- (in symbol AD8662, part A) -; +
- (in symbol AD8662, part B) -; +

### Library data of the parts
C56-C58 C68 = Cap_1206: Capacitor; Digikey Part-Number: *; Value: 1uF; Manufacturer Part-Number: *
C66 C70 = Cap_0603: Value: 120pF; MF: *; MPN: *; Supplier 1: *; Supplier 2: *; Supplier Part Number 1: *; Supplier Part Number 2: *
C100 C101 = Cap_0603: MPN: 885012206071; MF: Würth; Voltage: 25V; Value: 100nF; Supplier 1: Mouser; Supplier 2: *; Supplier Part Number 1: 710-885012206071; Supplier Part Number 2: *
D1 D2 = Diode Array: DIODE ARRAY GP 100V 215MA SOT23; MF: Nexperia; Supplier Part Number 2: 1727-4311-1-ND; MPN: BAV99,235; Supplier 1: Mouser; Supplier 2: Digi-Key; Package: SOT-23-3; Supplier Part Number 1: 771-BAV99235
Q1 Q3 = NPN Transistor BC846: NPN Bipolar Transistor; MF: ON Semiconductor; Supplier Part Number 2: BC846BLT3GOSCT-ND; MPN: BC846BLT3G; Supplier 1: Mouser; Supplier 2: Digi-Key; Supplier Part Number 1: 863-BC846BLT3G; Package: SOT-23-3
Q2 Q4 = PNP Transistor BC846: PNP Bipolar Transistor; MF: Nexperia; Supplier Part Number 2: 1727-2925-1-ND; MPN: BC856B,215; Supplier Part Number 1: 771-BC856B-T/R; Supplier 1: Mouser; Supplier 2: Digi-Key; Package: SOT-23-3
R36 R38 R41 R44 R48 R51-R54 R60 R61 R64 R65 = R_0603: MPN: CRCW06030000Z0EAC; MF: Vishay; Supplier 1: Mouser; Supplier Part Number 1: 71-CRCW06030000Z0EAC
  R36 R53: Value: 15.4k
  R38 R52 R54 R65: Value: 2.2k
  R41 R51 R60 R64: Value: 3.3
  R44 R48 R61: Value: 10k
R37 = R_0603: Value: 22k; MF: *; MPN: *; Supplier 1: *; Supplier Part Number 1: *
R49 R50 R62 R63 = R_0603: MF: Vishay; Value: 4.7; Supplier 1: Mouser
TP19 = TP_1mm: Testpoint 1mm; Created: 2018_06_25_AGeiger; Value: Testpoint 1mm
U1 = AD8662: IC OPAMP GP 2 CIRCUIT 14SOIC; MF: Analog Devices; MPN: AD8662ARZ; Supplier Part Number 2: AD8662ARZ-ND; Package: SOIC-8; Supplier 1: Mouser; Supplier 2: Digi-Key; Supplier Part Number 1: 584-AD8662ARZ
U13 = CMP-0244-00186-1: Precision 500mA Regulator, 12V, 3-Pin DPAK, Tape and Reel; ComponentLink2Description: Datasheet; PackageDescription: 3-Pin Transistor Outline Package 2.28 mm Pitch, 9.7 mm Lead Span (DPAK); PackageVersion: 2011; ComponentLink2URL: http://www.st.com/internet/com/TECHNICAL_RESOURCES/TECHNICAL_LITERATURE/DATASHEET/CD00000448.pdf; ComponentLink1URL: http://www.st.com; PackageReference: TO-252; DatasheetVersion: 1/11/2010; ComponentLink1Description: Manufacturer URL

## Sheet Impedance converter.SchDoc
size A4; Author: Julian Klein; CompanyName: Technische Hochschule Nürnberg Georg Simon Ohm; Organization: UltraZohm; Address1: Kesslerplatz 12; Address2: 90489 Nürnberg; Address3: GERMANY; DocumentNumber: 12; SheetNumber: 12; SheetTotal: 12; Website: www.ultrazohm.com
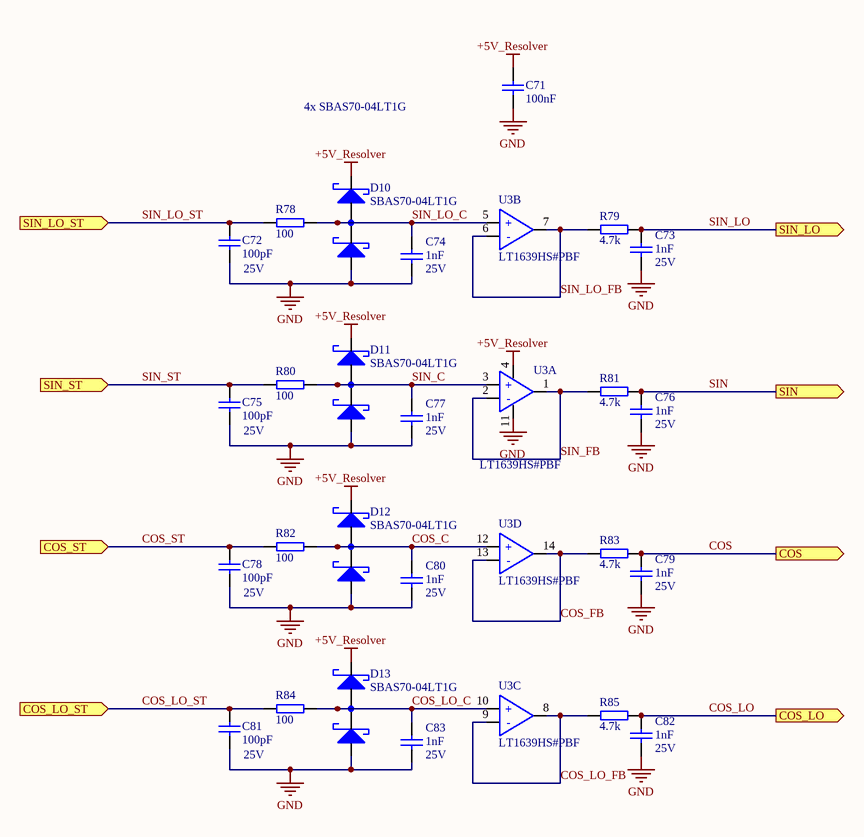
[diagram p13: Impedance converter.SchDoc]

### Parts
C71  100nF  [CAPC1608X07N]
C72  100pF  Voltage: 25V  [CAPC1608X07N]
C73  1nF  Voltage: 25V  [CAPC1608X07N]
C74  1nF  Voltage: 25V  [CAPC1608X07N]
C75  100pF  Voltage: 25V  [CAPC1608X07N]
C76  1nF  Voltage: 25V  [CAPC1608X07N]
C77  1nF  Voltage: 25V  [CAPC1608X07N]
C78  100pF  Voltage: 25V  [CAPC1608X07N]
C79  1nF  Voltage: 25V  [CAPC1608X07N]
C80  1nF  Voltage: 25V  [CAPC1608X07N]
C81  100pF  Voltage: 25V  [CAPC1608X07N]
C82  1nF  Voltage: 25V  [CAPC1608X07N]
C83  1nF  Voltage: 25V  [CAPC1608X07N]
D10  SBAS70-04LT1G  [SOT-23]
D11  SBAS70-04LT1G  [SOT-23]
D12  SBAS70-04LT1G  [SOT-23]
D13  SBAS70-04LT1G  [SOT-23]
R78  100  [RESC1608X06N]
R79  4.7k  [RESC1608X06N]
R80  100  [RESC1608X06N]
R81  4.7k  [RESC1608X06N]
R82  100  [RESC1608X06N]
R83  4.7k  [RESC1608X06N]
R84  100  [RESC1608X06N]
R85  4.7k  [RESC1608X06N]
U3  LT1639HS#PBF  [SOIC-14]  (parts A,B,C,D of 4)

### Ports
COS (out), COS_LO (out), COS_LO_ST (in), COS_ST (in), SIN (out), SIN_LO (out), SIN_LO_ST (in), SIN_ST (in)

### Nets
+5V_Resolver: C71.1 D10.2 D11.2 D12.2 D13.2 U3.4(V+)
GND: C71.2 C72.2 C73.2 C74.2 C75.2 C76.2 C77.2 C78.2 C79.2 C80.2 C81.2 C82.2 C83.2 D10.1 D11.1 D12.1 D13.1 U3.11(V-)
COS: C79.1 R83.2 ; port COS
COS_C: C80.1 D12.3 R82.2 U3.12(+)
COS_FB: R83.1 U3.13(-) U3.14
COS_LO: C82.1 R85.2 ; port COS_LO
COS_LO_C: C83.1 D13.3 R84.2 U3.10(+)
COS_LO_FB: R85.1 U3.8 U3.9(-)
COS_LO_ST: C81.1 R84.1 ; port COS_LO_ST
COS_ST: C78.1 R82.1 ; port COS_ST
SIN: C76.1 R81.2 ; port SIN
SIN_C: C77.1 D11.3 R80.2 U3.3(+)
SIN_FB: R81.1 U3.1 U3.2(-)
SIN_LO: C73.1 R79.2 ; port SIN_LO
SIN_LO_C: C74.1 D10.3 R78.2 U3.5(+)
SIN_LO_FB: R79.1 U3.6(-) U3.7
SIN_LO_ST: C72.1 R78.1 ; port SIN_LO_ST
SIN_ST: C75.1 R80.1 ; port SIN_ST

### Notes on the sheet
- 4x SBAS70-04LT1G
- Title
- Revision:
- Design Engineer:
- Date:
- Project:
- Sheet
- of

### Library data of the parts
C71 = Cap_0603: as C100 on sheet Buffer_EXC; Value: 100nF; Supplier 1: Mouser; Supplier 2: *; Supplier Part Number 1: 710-885012206071; Supplier Part Number 2: *
C72-C83 = Cap_0603: MF: *; MPN: *; Supplier 1: *; Supplier 2: *; Supplier Part Number 1: *; Supplier Part Number 2: *
  C72 C75 C78 C81: Value: 100pF
  C73 C74 C76 C77 C79 C80 C82 C83: Value: 1nF
D10-D13 = Diode Array Schottky: DIODE SCHOTTKY 70V DUAL SOT23; MF: ON Semiconductor; Supplier Part Number 2: SBAS70-04LT1GOSCT-ND; MPN: SBAS70-04LT1G; Supplier Part Number 1: 863-SBAS70-04LT1G; Package: SOT-23-3; Supplier 1: Mouser; Supplier 2: Digi-Key
R78-R85 = R_0603: MF: *; MPN: *; Supplier 1: *; Supplier Part Number 1: *
  R78 R80 R82 R84: Value: 100
  R79 R81 R83 R85: Value: 4.7k
U3 = LT1639: IC OPAMP GP 4 CIRCUIT 14SO; MF: Analog Devices; Supplier Part Number 2: LT1639HS#PBF-ND; MPN: LT1639HS#PBF; Supplier Part Number 1: 584-LT1639HS#PBF; Package: SO-14; Supplier 1: Mouser; Supplier 2: Digikey

## Sheet Incremental Encoder.SchDoc
size A4; Author: Julian Klein; CompanyName: Technische Hochschule Nürnberg Georg Simon Ohm; Organization: UltraZohm; Address1: Kesslerplatz 12; Address2: 90489 Nürnberg; Address3: GERMANY; DocumentNumber: 7; SheetNumber: 7; SheetTotal: 12; Website: www.ultrazohm.com
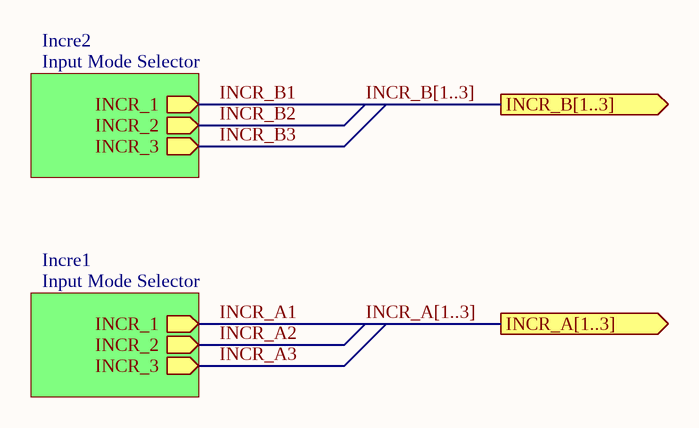
[diagram p14: Incremental Encoder.SchDoc]

### Sub-sheets
Incre1 = Input Mode Selector: INCR_2 (out), INCR_1 (out), INCR_3 (out)
Incre2 = Input Mode Selector: INCR_2 (out), INCR_1 (out), INCR_3 (out)

### Ports
INCR_A[1..3] (out), INCR_B[1..3] (out)

### Buses and harness runs
bus INCR_A[1..3] = port INCR_A[1..3]
bus INCR_B[1..3] = port INCR_B[1..3]

### Notes on the sheet
- Title
- Revision:
- Design Engineer:
- Date:
- Project:
- Sheet
- of

## Sheet Input Mode Selector.SchDoc
size A4; Author: Julian Klein; CompanyName: Technische Hochschule Nürnberg Georg Simon Ohm; Organization: UltraZohm; Address1: Kesslerplatz 12; Address2: 90489 Nürnberg; Address3: GERMANY; DocumentNumber: 8; SheetNumber: 8; SheetTotal: 12; Website: www.ultrazohm.com
Used 2 times, as channels Incremental Encoder/Incre2, Incremental Encoder/Incre1. Parts and nets are listed once, with the designators drawn on the sheet.
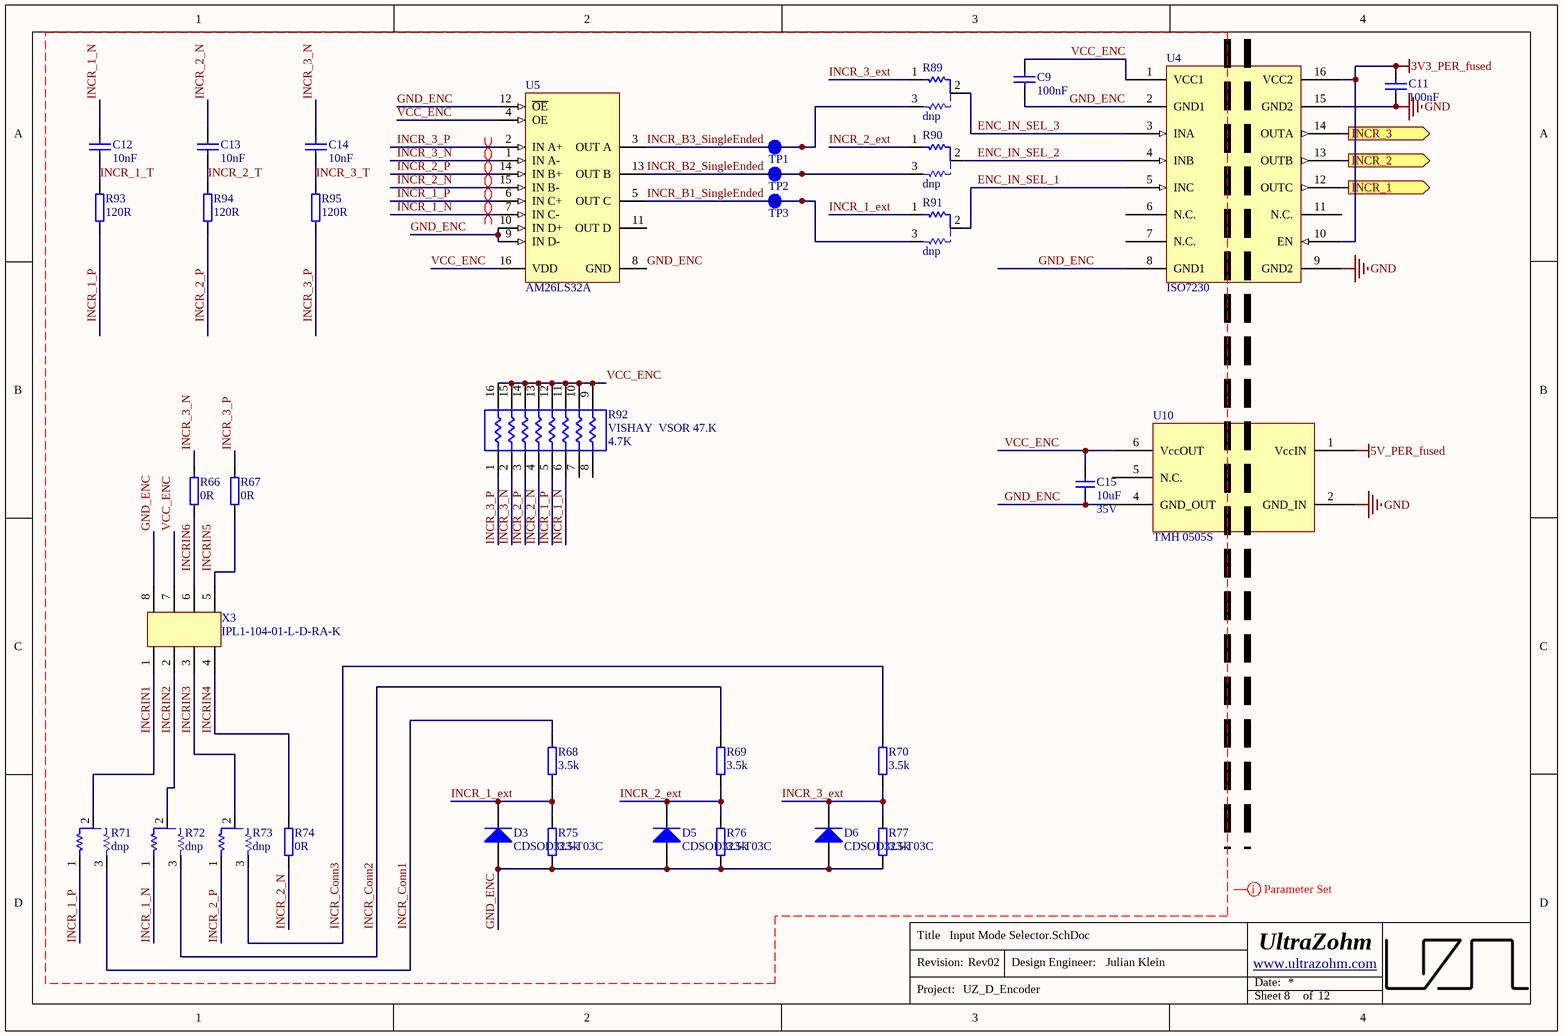
[diagram p15: Input Mode Selector.SchDoc]

### Parts
C9  100nF  [CAPC1608X07N]
C11  100nF  [CAPC1608X07N]
C12  10nF  [CAPC1608X07N]
C13  10nF  [CAPC1608X07N]
C14  10nF  [CAPC1608X07N]
C15  10uF  Voltage: 35V  [C_1206]
D3  CDSOD323-T03C  [SOD-323]
D5  CDSOD323-T03C  [SOD-323]
D6  CDSOD323-T03C  [SOD-323]
R66  0R  [RESC1608X06N]
R67  0R  [RESC1608X06N]
R68  3.5k  [RESC1608X06N]
R69  3.5k  [RESC1608X06N]
R70  3.5k  [RESC1608X06N]
R71  dnp  [0603_Config]
R72  dnp  [0603_Config]
R73  dnp  [0603_Config]
R74  0R  [RESC1608X06N]
R75  3.5k  [RESC1608X06N]
R76  3.5k  [RESC1608X06N]
R77  3.5k  [RESC1608X06N]
R89  dnp  [0603_Config]
R90  dnp  [0603_Config]
R91  dnp  [0603_Config]
R92  VISHAY  VSOR 47.K  value 4.7K  [SO-16_N]
R93  120R  [RESC1608X06N]
R94  120R  [RESC1608X06N]
R95  120R  [RESC1608X06N]
TP1  VCC  [TP_1mm]  (value not drawn)
TP2  VCC  [TP_1mm]  (value not drawn)
TP3  VCC  [TP_1mm]  (value not drawn)
U4  ISO7230  [SOIC-16_wide-body]
U5  AM26LS32A  [M16A_N]
U10  TMH 0505S  [SIL-6(7)]
X3  IPL1-104-01-L-D-RA-K  [Conector 4x2 TH Horizontal]

### Ports
INCR_1 (out), INCR_2 (out), INCR_3 (out)

### Nets
3V3_PER_fused: C11.2 U4.10(EN) U4.16(VCC2)
5V_PER_fused: U10.1(VccIN)
GND: C11.1 U4.9(GND2) U4.15(GND2) U10.2(GND_IN)
ENC_IN_SEL_1: R91.2 U4.5(INC)
ENC_IN_SEL_2: R90.2 U4.4(INB)
ENC_IN_SEL_3: R89.2 U4.3(INA)
GND_ENC: C9.1 C15.1 D3.2(A) D5.2(A) D6.2(A) R75.2 R76.2 R77.2 U4.2(GND1) U4.8(GND1) U5.8(GND) U5.9(IN_D-) U5.10(IN_D+) U5.12(~{OE}) U10.4(GND_OUT) X3.8
INCR_1: U4.12(OUTC) ; port INCR_1
INCR_1_ext: D3.1(K) R68.2 R75.1 R91.1
INCR_1_N: C12.2 R72.1 R92.6 U5.7(IN_C-)
INCR_1_P: R71.1 R92.5 R93.1 U5.6(IN_C+)
INCR_1_T: C12.1 R93.2
INCR_2: U4.13(OUTB) ; port INCR_2
INCR_2_ext: D5.1(K) R69.2 R76.1 R90.1
INCR_2_N: C13.2 R74.1 R92.4 U5.15(IN_B-)
INCR_2_P: R73.1 R92.3 R94.1 U5.14(IN_B+)
INCR_2_T: C13.1 R94.2
INCR_3: U4.14(OUTA) ; port INCR_3
INCR_3_ext: D6.1(K) R70.2 R77.1 R89.1
INCR_3_N: C14.2 R66.2 R92.2 U5.1(IN_A-)
INCR_3_P: R67.2 R92.1 R95.1 U5.2(IN_A+)
INCR_3_T: C14.1 R95.2
INCR_B1_SingleEnded: R91.3 TP3.1 U5.5(OUT_C)
INCR_B2_SingleEnded: R90.3 TP2.1 U5.13(OUT_B)
INCR_B3_SingleEnded: R89.3 TP1.1 U5.3(OUT_A)
INCR_Conn1: R68.1 R71.3
INCR_Conn2: R69.1 R72.3
INCR_Conn3: R70.1 R73.3
INCRIN1: R71.2 X3.1
INCRIN2: R72.2 X3.2
INCRIN3: R73.2 X3.3
INCRIN4: R74.2 X3.4
INCRIN5: R67.1 X3.5
INCRIN6: R66.1 X3.6
VCC_ENC: C9.2 C15.2 R92.9 R92.10 R92.11 R92.12 R92.13 R92.14 R92.15 R92.16 U4.1(VCC1) U5.4(OE) U5.16(VDD) U10.6(VccOUT) X3.7

Not connected (* = marked no-connect by the designer): R92 7 8; U4 6(N.C.) 7(N.C.) 11(N.C.); U5 11(OUT_D); U10 5(N.C.)

### Channels
Incremental Encoder/Incre2: designators end in A; ports INCR_1=INCR_B1 INCR_2=INCR_B2 INCR_3=INCR_B3
Incremental Encoder/Incre1: designators end in B; ports INCR_1=INCR_A1 INCR_2=INCR_A2 INCR_3=INCR_A3

### Layout directives
differential pair: INCR_1_N_Incre2, INCR_1_P_Incre2, INCR_2_N_Incre2, INCR_2_P_Incre2, INCR_3_N_Incre2, INCR_3_P_Incre2
net class isol_incre: (no net found under the mark)

### Notes on the sheet
- Title
- Revision:
- Design Engineer:
- Date:
- Project:
- Sheet
- of

### Library data of the parts
C9 C11 = Cap_0603: as C100 on sheet Buffer_EXC; Value: 100nF; Supplier 1: Mouser; Supplier 2: *; Supplier Part Number 1: 710-885012206071; Supplier Part Number 2: *
C12-C14 = Cap_0603: as C112 on sheet Resolver; Value: 10nF; Supplier 1: Mouser; Supplier 2: *; Supplier Part Number 1: 710-885012206065; Supplier Part Number 2: *
C15 = C_1206: as C114 on sheet Resolver; Package: 1206; Value: 10uF; Created: 2018_06_25_AGeiger; Supplier 1: Mouser; Supplier Part Number 1: 81-GRM319R6YA106KA2D
D3 D5 D6 = Diodo TVS: TVS DIODE 3.3V 19V SOD323; MF: Bourns; Supplier Part Number 2: CDSOD323-T03CCT-ND; MPN: CDSOD323-T03C; Supplier Part Number 1: 652-CDSOD323-T03C; Package: SOD-323-2; Supplier 2: Digi-Key; Supplier 1: Mouser
R66 R67 R74 = R_0603: MPN: CRCW06030000Z0EAC; MF: Vishay; Value: 0R; Supplier 1: Mouser; Supplier Part Number 1: 71-CRCW06030000Z0EAC
R68-R70 R75-R77 R93-R95 = R_0603: MF: *; MPN: *; Supplier 1: *; Supplier Part Number 1: *
  R68-R70 R75-R77: Value: 3.5k
  R93-R95: Value: 120R
R71-R73 R89-R91 = R_config: Solder 0603 resistor/jumper between pads 1 and 2 for standard function. Solter resistor between pads 2 and 3 for alternative function; MPN: MCWR06X1002FTL; Value: 0R; MF: Multicomp; Voltage: 50V; Power: 100mW; Tolerance: 1%; Created: 2018_09_04_AGeiger; Package: 0603; Supplier Part Number 1: 2447230; Supplier 1: Farnell
R92 = Res Pack3: Isolated Resistor Network; Published: 24-Mar-1999; LatestRevisionDate: 29-May-2009; LatestRevisionNote: IPC-7351 Footprint Added.; PackageReference: SO-16; Publisher: Altium Limited; PackageDescription: 16-Pin Small Outline Integrated Circuit 1.27 mm Pitch; Code_JEDEC: MS-012-AC; Code_IPC: SOIC127P600-16
TP1-TP3 = TP_1mm: Testpoint 1mm; Created: 2018_06_25_AGeiger; Value: Testpoint 1mm
U4 = TI ISO7230: High-Speed, Triple-Channel Digital Isolator; Supplier 1: Mouser; Supplier Part Number 1: 595-ISO7230CDWR
U5 = DS26LS32CM: Quad Differential Line Receiver, 16-pin Narrow SOIC; PartNumber: AM26LS32AIDR; Manufacturer: TI; CompType: Interface IC; Published: 4-Dec-2008; Supplier 1: Mouser; Supplier Part Number 1: 595-AM26LS32AIDR; PinCount: 16; ComponentLink3Description: M16A Package Page; ComponentLink3URL: http://www.national.com/packaging/folders/m16a.html
U10 = TRACO TMH 0505S: 5V/5V DC-DC Isolation Converter
X3 = Conector 4x2 Horizontal: CONN HEADER R/A 8POS 2.54MM Through Hole; MF: Samtec; Supplier Part Number 2: SAM9596-ND; MPN: IPL1-104-01-L-D-RA-K; Supplier Part Number 1: 200-IPL110401LDRAK; Supplier 1: Mouser; Supplier 2: Digi-Key